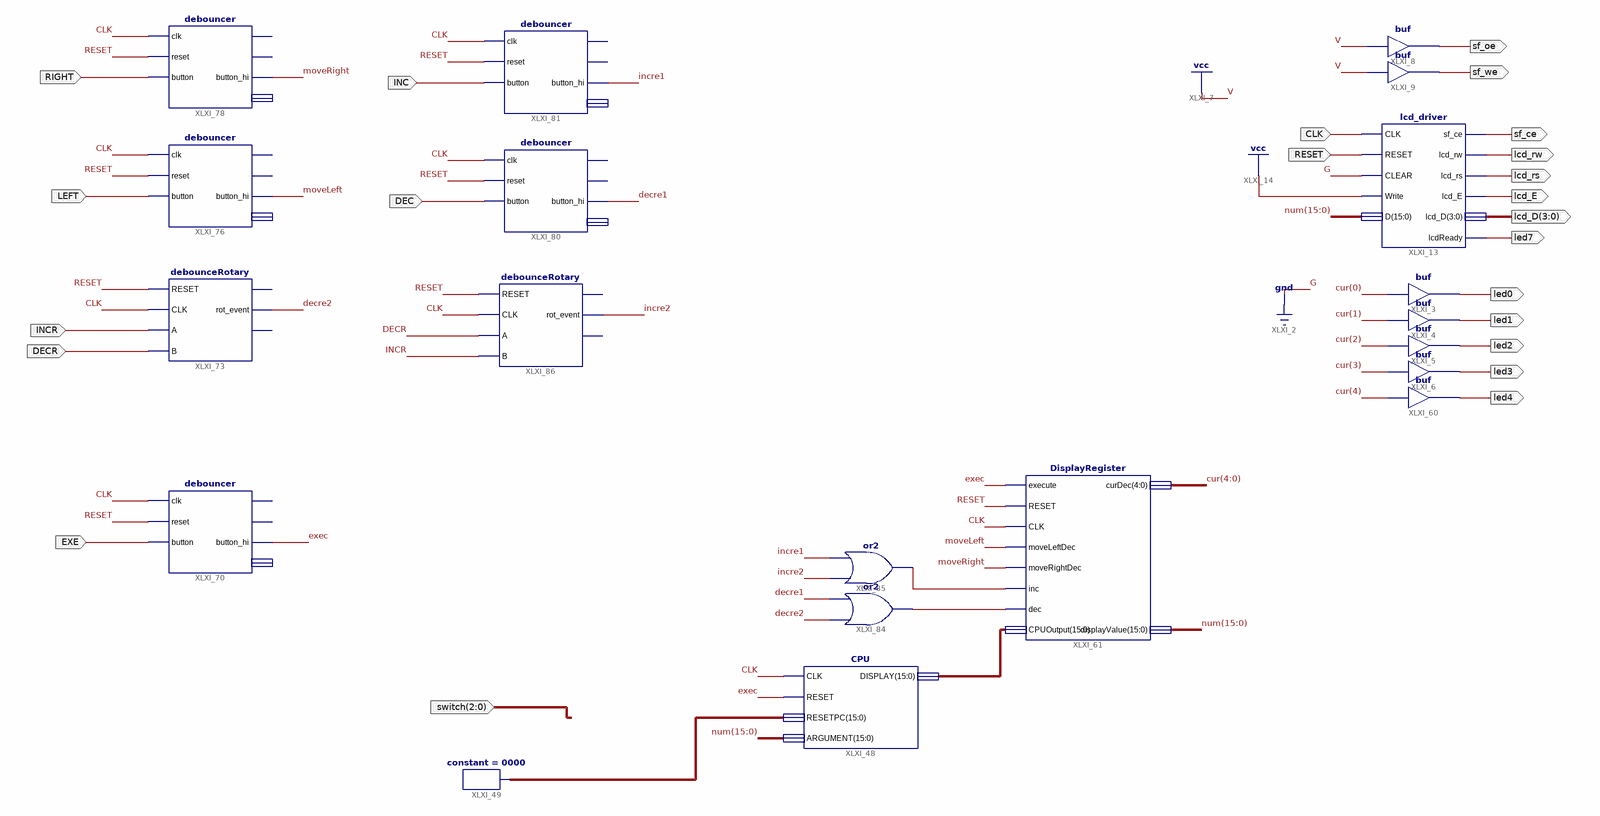
[diagram p0: schematic sheet 1]
// Xilinx ISE schematic io_block.sch (spartan3e) as structural Verilog: 20 symbols, 23 ports
module io_block (
  input  CLK,
  input  RESET,
  input  LEFT,
  input  RIGHT,
  input  INCR,
  input  DECR,
  input  DEC,
  input  INC,
  input  EXE,
  input  [2:0] switch,
  output sf_ce,
  output lcd_rw,
  output lcd_E,
  output lcd_rs,
  output [3:0] lcd_D,
  output led7,
  output led0,
  output led1,
  output led2,
  output led3,
  output sf_oe,
  output sf_we,
  output led4
);

  wire decre, decre1, decre2, exec, incre, incre1, incre2, moveLeft, moveRight;
  wire [4:0] cur;
  wire [15:0] display, num, XLXN_269;

  debouncer XLXI_76 (
    .clk(CLK), .reset(RESET), .button(LEFT), .button_hi(moveLeft));  // open: debutton, button_lo, count
  debouncer XLXI_78 (
    .clk(CLK), .reset(RESET), .button(RIGHT), .button_hi(moveRight));  // open: debutton, button_lo, count
  debouncer XLXI_80 (.clk(CLK), .reset(RESET), .button(DEC), .button_hi(decre1));  // open: debutton, button_lo, count
  debouncer XLXI_81 (.clk(CLK), .reset(RESET), .button(INC), .button_hi(incre1));  // open: debutton, button_lo, count
  lcd_driver XLXI_13 (
    .CLK(CLK), .RESET(RESET), .CLEAR(1'b0), .Write(1'b1), .D(num), .sf_ce(sf_ce), .lcd_rw(lcd_rw),
    .lcd_rs(lcd_rs), .lcd_D(lcd_D), .lcd_E(lcd_E), .lcdReady(led7));
  buf XLXI_3 (led0, cur[0]);
  buf XLXI_4 (led1, cur[1]);
  buf XLXI_5 (led2, cur[2]);
  buf XLXI_6 (led3, cur[3]);
  buf XLXI_8 (sf_oe, 1'b1);
  buf XLXI_9 (sf_we, 1'b1);
  buf XLXI_60 (led4, cur[4]);
  DisplayRegister XLXI_61 (
    .execute(exec), .RESET(RESET), .CLK(CLK), .moveLeftDec(moveLeft), .moveRightDec(moveRight), .inc(incre),
    .dec(decre), .CPUOutput(display), .curDec(cur), .displayValue(num));
  constant #(.CValue("0000")) XLXI_49 (.O(XLXN_269));
  CPU XLXI_48 (.CLK(CLK), .RESET(exec), .RESETPC(XLXN_269), .DISPLAY(display), .ARGUMENT(num));
  or XLXI_84 (decre, decre2, decre1);
  or XLXI_85 (incre, incre2, incre1);
  debounceRotary XLXI_73 (
    .CLK(CLK), .RESET(RESET), .A(INCR), .B(DECR), .rot_event(decre2));  // open: rot_left, rot_event_delay
  debounceRotary XLXI_86 (
    .CLK(CLK), .RESET(RESET), .A(DECR), .B(INCR), .rot_event(incre2));  // open: rot_left, rot_event_delay
  debouncer XLXI_70 (.clk(CLK), .reset(RESET), .button(EXE), .button_hi(exec));  // open: debutton, button_lo, count
endmodule
